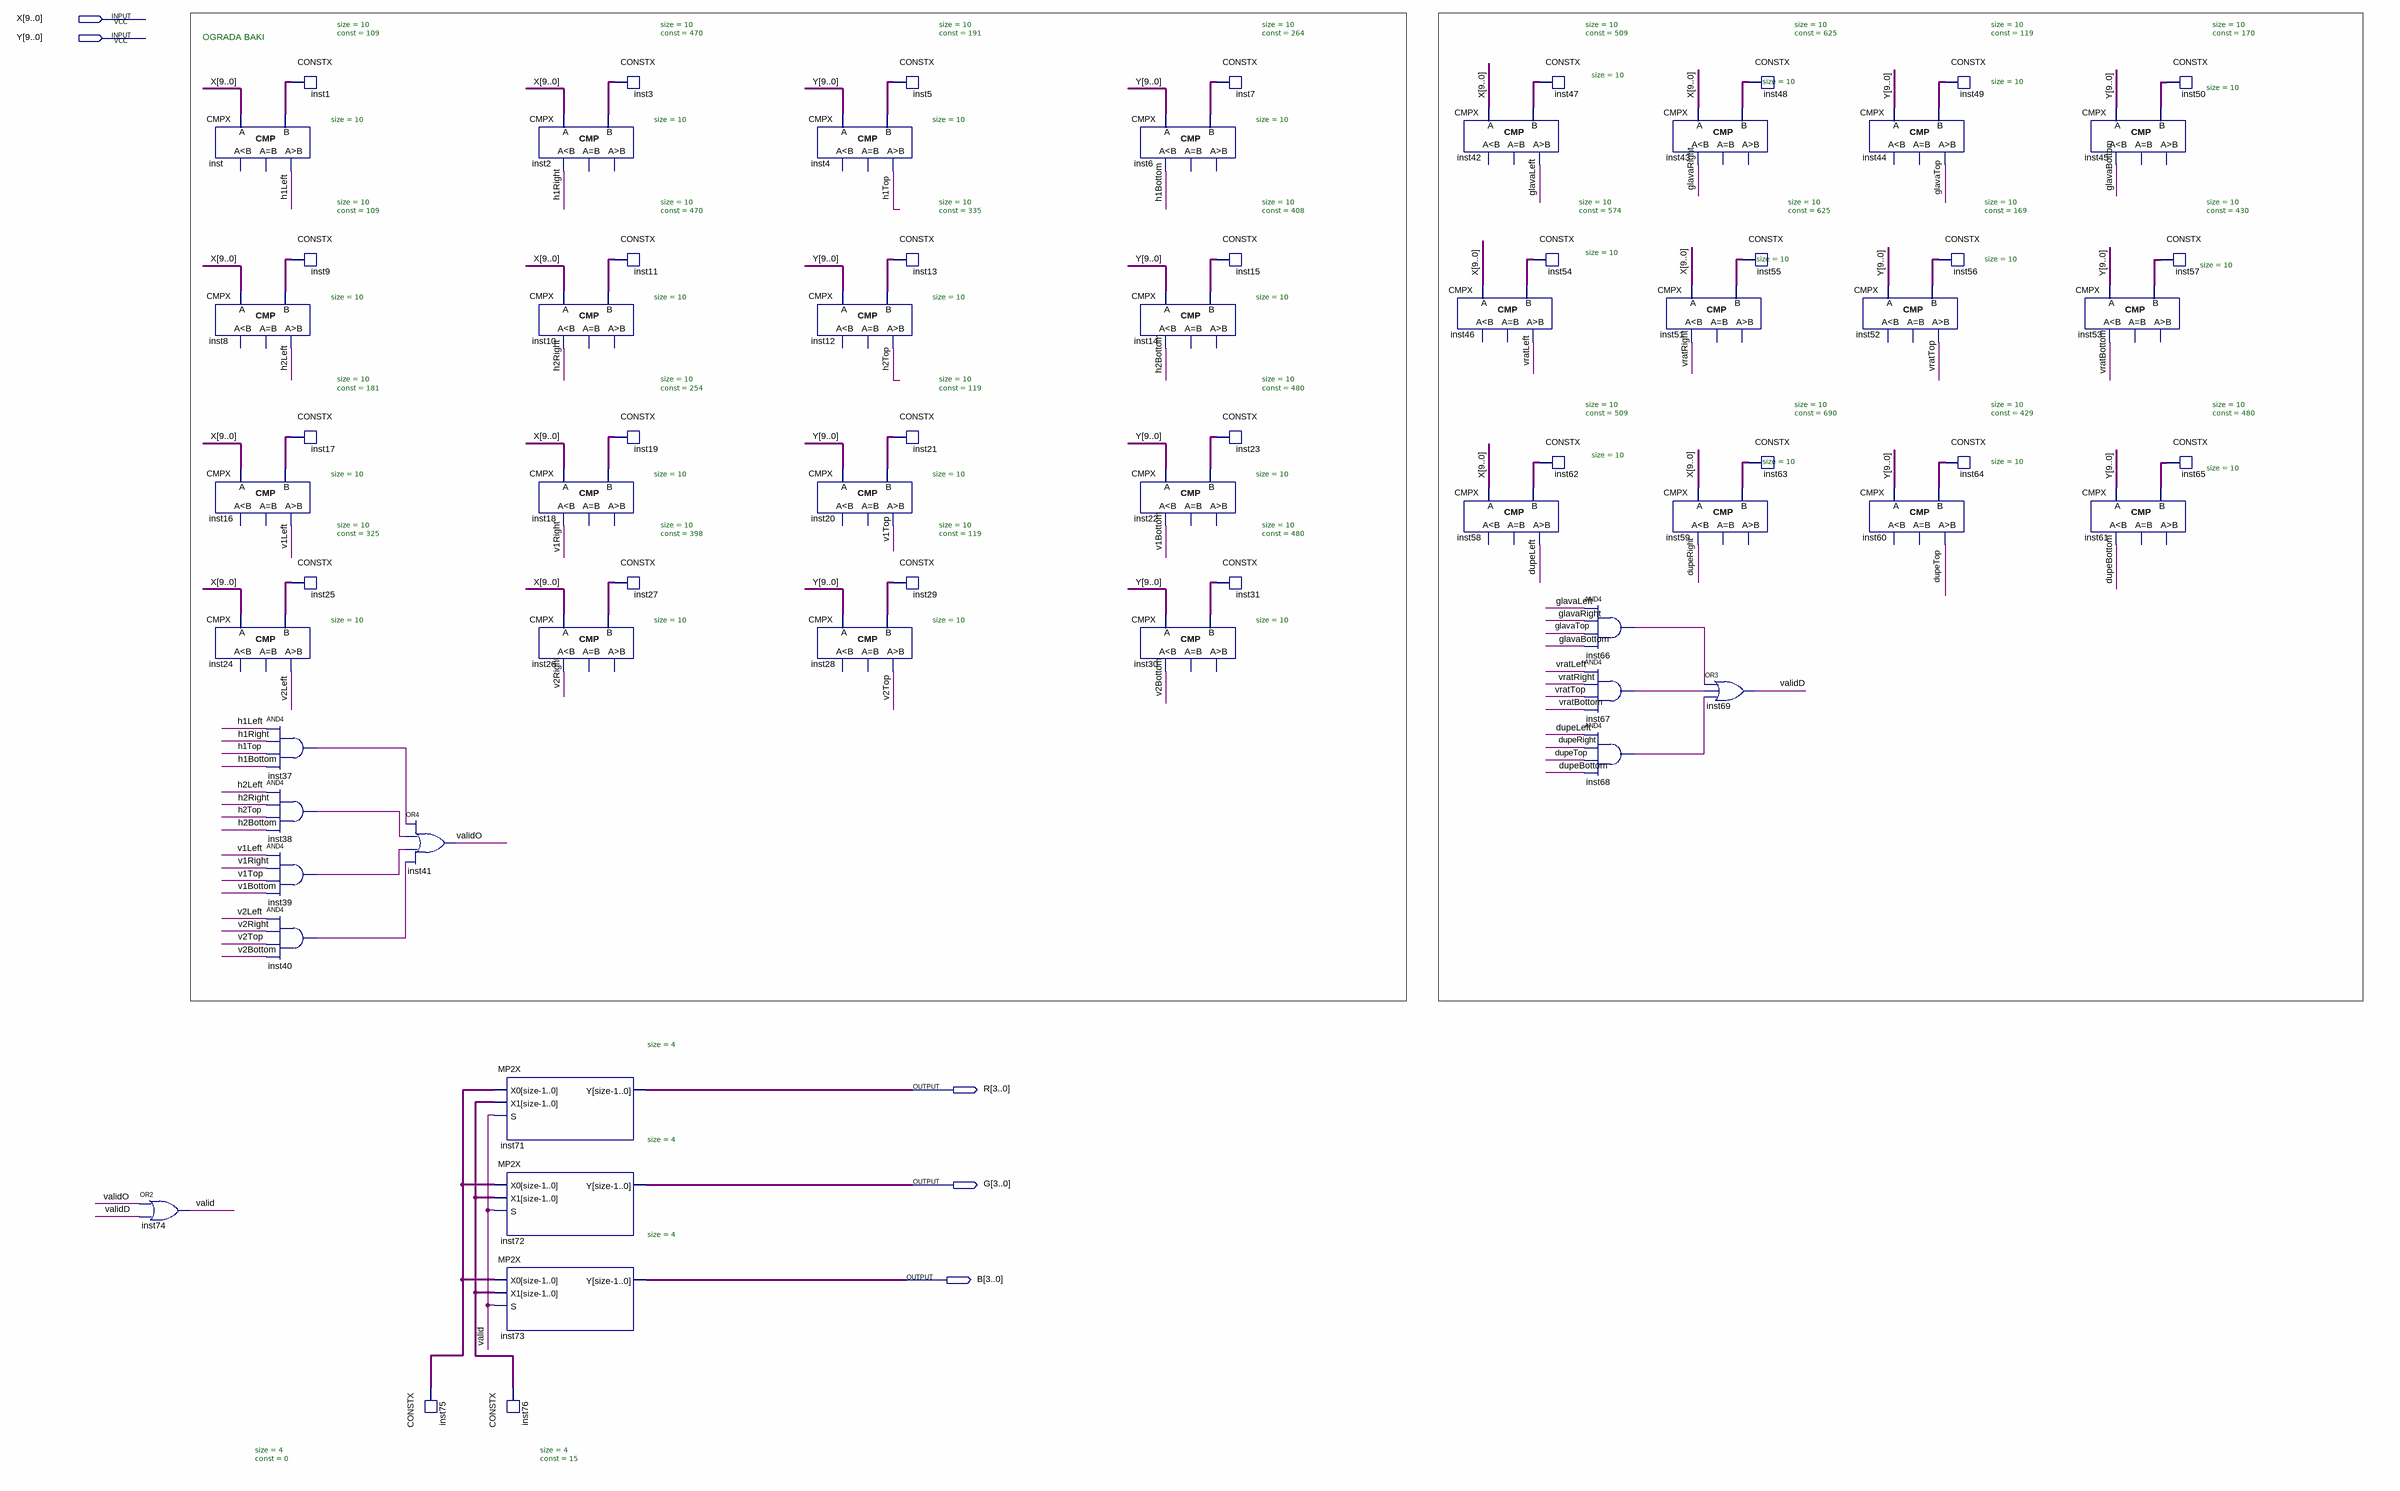
[diagram p0: schematic sheet]
// Quartus schematic Win.bdf as structural Verilog: 71 symbols, 5 pins
module Win (
  input  [9:0] X,
  input  [9:0] Y,
  output [3:0] R,
  output [3:0] G,
  output [3:0] B
);

  wire dupeBottom, dupeLeft, dupeRight, dupeTop, glavaBottom, glavaLeft, glavaRight, glavaTop, h1Bottom,
       h1Left, h1Right, h1Top, h2Bottom, h2Left, h2Right, h2Top, inst37_out, inst38_out, inst39_out,
       inst40_out, inst66_out, inst67_out, inst68_out, v1Bottom, v1Left, v1Right, v1Top, v2Bottom, v2Left,
       v2Right, v2Top, valid, validD, validO, vratBottom, vratLeft, vratRight, vratTop;
  wire [3:0] inst75_data, inst76_data;
  wire [9:0] inst1_data, inst3_data, inst5_data, inst7_data, inst9_data, inst11_data, inst13_data,
       inst15_data, inst17_data, inst19_data, inst21_data, inst23_data, inst25_data, inst27_data,
       inst29_data, inst31_data, inst47_data, inst48_data, inst49_data, inst50_data, inst54_data,
       inst55_data, inst56_data, inst57_data, inst62_data, inst63_data, inst64_data, inst65_data;

  or inst74 (valid, validO, validD);
  CMPX #(.size(10)) inst (.A(X), .B(inst1_data), .gr(h1Left));  // open: ls, eq
  CMPX #(.size(10)) inst8 (.A(X), .B(inst9_data), .gr(h2Left));  // open: ls, eq
  CMPX #(.size(10)) inst16 (.A(X), .B(inst17_data), .gr(v1Left));  // open: ls, eq
  CMPX #(.size(10)) inst24 (.A(X), .B(inst25_data), .gr(v2Left));  // open: ls, eq
  CONSTX #(.size(10), .\const (109)) inst1 (.data(inst1_data));
  CONSTX #(.size(10), .\const (109)) inst9 (.data(inst9_data));
  CONSTX #(.size(10), .\const (181)) inst17 (.data(inst17_data));
  CONSTX #(.size(10), .\const (325)) inst25 (.data(inst25_data));
  and inst37 (inst37_out, h1Left, h1Right, h1Top, h1Bottom);
  and inst38 (inst38_out, h2Left, h2Right, h2Top, h2Bottom);
  and inst39 (inst39_out, v1Left, v1Right, v1Top, v1Bottom);
  and inst40 (inst40_out, v2Left, v2Right, v2Top, v2Bottom);
  or inst41 (validO, inst37_out, inst38_out, inst39_out, inst40_out);
  CONSTX #(.size(4), .\const (0)) inst75 (.data(inst75_data));
  MP2X #(.size(4)) inst71 (.X0(inst75_data), .X1(inst76_data), .S(valid), .Y(R));
  MP2X #(.size(4)) inst72 (.X0(inst75_data), .X1(inst76_data), .S(valid), .Y(G));
  MP2X #(.size(4)) inst73 (.X0(inst75_data), .X1(inst76_data), .S(valid), .Y(B));
  CONSTX #(.size(4), .\const (15)) inst76 (.data(inst76_data));
  CMPX #(.size(10)) inst2 (.A(X), .B(inst3_data), .ls(h1Right));  // open: eq, gr
  CMPX #(.size(10)) inst10 (.A(X), .B(inst11_data), .ls(h2Right));  // open: eq, gr
  CMPX #(.size(10)) inst18 (.A(X), .B(inst19_data), .ls(v1Right));  // open: eq, gr
  CMPX #(.size(10)) inst26 (.A(X), .B(inst27_data), .ls(v2Right));  // open: eq, gr
  CONSTX #(.size(10), .\const (470)) inst3 (.data(inst3_data));
  CONSTX #(.size(10), .\const (470)) inst11 (.data(inst11_data));
  CONSTX #(.size(10), .\const (254)) inst19 (.data(inst19_data));
  CONSTX #(.size(10), .\const (398)) inst27 (.data(inst27_data));
  CMPX #(.size(10)) inst4 (.A(Y), .B(inst5_data), .gr(h1Top));  // open: ls, eq
  CMPX #(.size(10)) inst12 (.A(Y), .B(inst13_data), .gr(h2Top));  // open: ls, eq
  CMPX #(.size(10)) inst20 (.A(Y), .B(inst21_data), .gr(v1Top));  // open: ls, eq
  CMPX #(.size(10)) inst28 (.A(Y), .B(inst29_data), .gr(v2Top));  // open: ls, eq
  CONSTX #(.size(10), .\const (191)) inst5 (.data(inst5_data));
  CONSTX #(.size(10), .\const (335)) inst13 (.data(inst13_data));
  CONSTX #(.size(10), .\const (119)) inst21 (.data(inst21_data));
  CONSTX #(.size(10), .\const (119)) inst29 (.data(inst29_data));
  CMPX #(.size(10)) inst6 (.A(Y), .B(inst7_data), .ls(h1Bottom));  // open: eq, gr
  CMPX #(.size(10)) inst14 (.A(Y), .B(inst15_data), .ls(h2Bottom));  // open: eq, gr
  CMPX #(.size(10)) inst22 (.A(Y), .B(inst23_data), .ls(v1Bottom));  // open: eq, gr
  CMPX #(.size(10)) inst30 (.A(Y), .B(inst31_data), .ls(v2Bottom));  // open: eq, gr
  CONSTX #(.size(10), .\const (264)) inst7 (.data(inst7_data));
  CONSTX #(.size(10), .\const (408)) inst15 (.data(inst15_data));
  CONSTX #(.size(10), .\const (480)) inst23 (.data(inst23_data));
  CONSTX #(.size(10), .\const (480)) inst31 (.data(inst31_data));
  CMPX #(.size(10)) inst42 (.A(X), .B(inst47_data), .gr(glavaLeft));  // open: ls, eq
  CMPX #(.size(10)) inst46 (.A(X), .B(inst54_data), .gr(vratLeft));  // open: ls, eq
  CMPX #(.size(10)) inst58 (.A(X), .B(inst62_data), .gr(dupeLeft));  // open: ls, eq
  CONSTX #(.size(10), .\const (509)) inst47 (.data(inst47_data));
  CONSTX #(.size(10), .\const (574)) inst54 (.data(inst54_data));
  CONSTX #(.size(10), .\const (509)) inst62 (.data(inst62_data));
  and inst66 (inst66_out, glavaLeft, glavaRight, glavaTop, glavaBottom);
  and inst67 (inst67_out, vratLeft, vratRight, vratTop, vratBottom);
  and inst68 (inst68_out, dupeLeft, dupeRight, dupeTop, dupeBottom);
  CMPX #(.size(10)) inst43 (.A(X), .B(inst48_data), .ls(glavaRight));  // open: eq, gr
  CMPX #(.size(10)) inst51 (.A(X), .B(inst55_data), .ls(vratRight));  // open: eq, gr
  CMPX #(.size(10)) inst59 (.A(X), .B(inst63_data), .ls(dupeRight));  // open: eq, gr
  or inst69 (validD, inst66_out, inst67_out, inst68_out);
  CONSTX #(.size(10), .\const (625)) inst48 (.data(inst48_data));
  CONSTX #(.size(10), .\const (625)) inst55 (.data(inst55_data));
  CONSTX #(.size(10), .\const (690)) inst63 (.data(inst63_data));
  CMPX #(.size(10)) inst44 (.A(Y), .B(inst49_data), .gr(glavaTop));  // open: ls, eq
  CMPX #(.size(10)) inst52 (.A(Y), .B(inst56_data), .gr(vratTop));  // open: ls, eq
  CMPX #(.size(10)) inst60 (.A(Y), .B(inst64_data), .gr(dupeTop));  // open: ls, eq
  CONSTX #(.size(10), .\const (119)) inst49 (.data(inst49_data));
  CONSTX #(.size(10), .\const (169)) inst56 (.data(inst56_data));
  CONSTX #(.size(10), .\const (429)) inst64 (.data(inst64_data));
  CMPX #(.size(10)) inst45 (.A(Y), .B(inst50_data), .ls(glavaBottom));  // open: eq, gr
  CMPX #(.size(10)) inst53 (.A(Y), .B(inst57_data), .ls(vratBottom));  // open: eq, gr
  CMPX #(.size(10)) inst61 (.A(Y), .B(inst65_data), .ls(dupeBottom));  // open: eq, gr
  CONSTX #(.size(10), .\const (170)) inst50 (.data(inst50_data));
  CONSTX #(.size(10), .\const (430)) inst57 (.data(inst57_data));
  CONSTX #(.size(10), .\const (480)) inst65 (.data(inst65_data));

  // Notes on the sheet:
  //   OGRADA BAKI
endmodule
